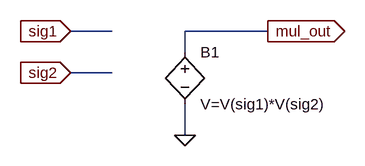
[diagram p0: schematic mul_lv1.asc]
mul_lv1.asc, the LTspice schematic file:
Version 4.1
SHEET 1 880 680
WIRE 0 64 -64 64
WIRE 240 64 112 64
WIRE 112 96 112 64
WIRE 0 128 -64 128
WIRE 112 224 112 176
FLAG 112 224 0
FLAG -64 64 sig1
IOPIN -64 64 In
FLAG 240 64 mul_out
IOPIN 240 64 Out
FLAG -64 128 sig2
IOPIN -64 128 In
SYMBOL bv 112 80 R0
SYMATTR InstName B1
SYMATTR Value V=V(sig1)*V(sig2)

The netlist it stands for:
* mul_lv1.asc
B1 mul_out 0 V=V(sig1)*V(sig2)
.backanno
.end